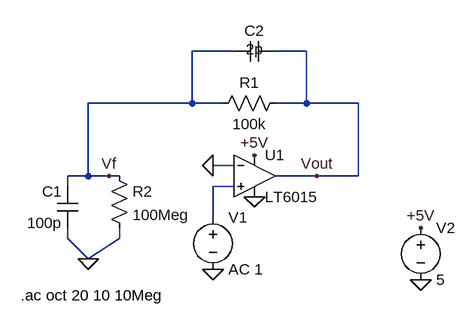
[diagram p0: schematic photodiode.asc]
photodiode.asc, the LTspice schematic file:
Version 4
SHEET 1 880 680
WIRE 192 -32 128 -32
WIRE 304 -32 256 -32
WIRE 128 48 128 -32
WIRE 128 48 -32 48
WIRE 176 48 128 48
WIRE 304 48 304 -32
WIRE 304 48 256 48
WIRE 384 48 304 48
WIRE 192 144 160 144
WIRE -32 160 -32 48
WIRE -32 160 -64 160
WIRE 0 160 -32 160
WIRE 16 160 0 160
WIRE 320 160 256 160
WIRE 384 160 384 48
WIRE 384 160 320 160
WIRE -64 176 -64 160
WIRE 192 176 160 176
WIRE 160 224 160 176
WIRE -64 256 -64 240
WIRE 16 256 16 240
WIRE -32 288 -64 256
WIRE -32 288 16 256
FLAG 160 304 0
FLAG 480 320 0
FLAG -32 288 0
FLAG 160 144 0
FLAG 224 128 +5V
FLAG 480 240 +5V
FLAG 320 160 Vout
FLAG 224 192 0
FLAG 0 160 Vf
SYMBOL Opamps\\LT6015 224 160 R0
SYMATTR InstName U1
SYMBOL res 160 64 R270
WINDOW 0 32 56 VTop 2
WINDOW 3 0 56 VBottom 2
SYMATTR InstName R1
SYMATTR Value 100k
SYMBOL res 0 144 R0
SYMATTR InstName R2
SYMATTR Value 100Meg
SYMBOL cap -48 176 M0
SYMATTR InstName C1
SYMATTR Value 100p
SYMBOL cap 256 -16 M270
WINDOW 0 32 32 VTop 2
WINDOW 3 4 32 VTop 2
SYMATTR InstName C2
SYMATTR Value 2p
SYMBOL voltage 160 208 R0
WINDOW 123 0 0 Left 2
WINDOW 39 0 0 Left 2
SYMATTR InstName V1
SYMATTR Value AC 1
SYMBOL voltage 480 224 R0
SYMATTR InstName V2
SYMATTR Value 5
TEXT -136 344 Left 2 !.ac oct 20 10 10Meg

The netlist it stands for:
* photodiode.asc
XU1 N001 0 +5V 0 Vout LT6016  ; LT6015, pins In+ In- V+ V- OUT
R1 Vf Vout 100k
R2 Vf 0 100Meg
C1 Vf 0 100p
C2 Vout Vf 2p
V1 N001 0 AC 1
V2 +5V 0 5
.ac oct 20 10 10Meg
.lib LTC2.lib
.backanno
.end